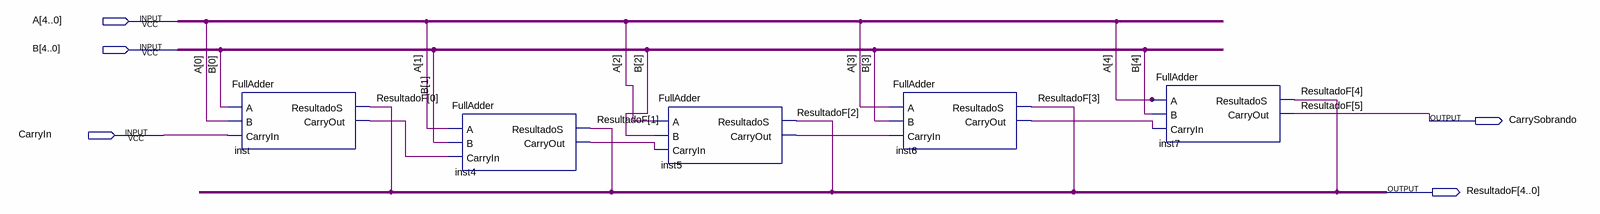
[diagram p0: schematic sheet]
// Quartus schematic Somador5bits.bdf as structural Verilog: 5 symbols, 5 pins
module Somador5bits (
  input  [4:0] A,
  input  [4:0] B,
  input  CarryIn,
  output CarrySobrando,
  output [4:0] ResultadoF
);

  wire inst4_carryout, inst5_carryout, inst6_carryout, inst_carryout;

  FullAdder inst (.A(B[0]), .B(A[0]), .CarryIn(CarryIn), .ResultadoS(ResultadoF[0]), .CarryOut(inst_carryout));
  FullAdder inst4 (.A(A[1]), .B(B[1]), .CarryIn(inst_carryout), .ResultadoS(ResultadoF[1]), .CarryOut(inst4_carryout));
  FullAdder inst5 (.A(A[2]), .B(B[2]), .CarryIn(inst4_carryout), .ResultadoS(ResultadoF[2]), .CarryOut(inst5_carryout));
  FullAdder inst6 (.A(A[3]), .B(B[3]), .CarryIn(inst5_carryout), .ResultadoS(ResultadoF[3]), .CarryOut(inst6_carryout));
  FullAdder inst7 (.A(A[4]), .B(B[4]), .CarryIn(inst6_carryout), .ResultadoS(ResultadoF[4]), .CarryOut(CarrySobrando));

  // Other names for the same wires on the sheet: ResultadoF[5] = CarrySobrando
endmodule
